# EAGLE design KoncovaCast (EAGLE 6.4)
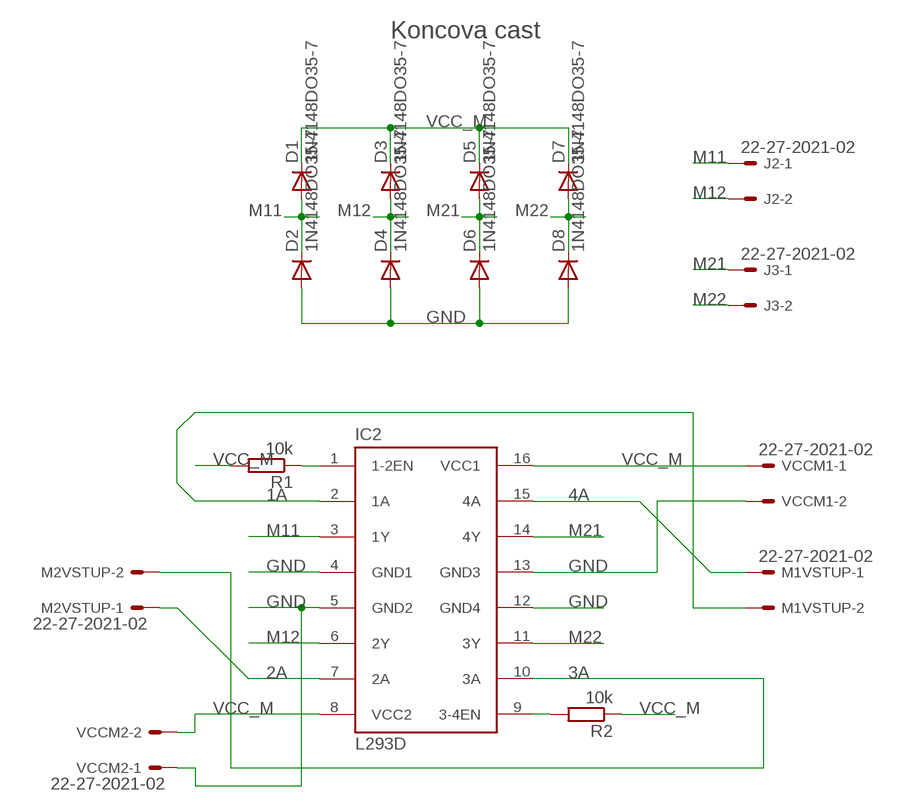
[diagram p0: schematic, sheet 1]

## Parts
D1  1N4148DO35-7  [DO35-7]
D2  1N4148DO35-7  [DO35-7]
D3  1N4148DO35-7  [DO35-7]
D4  1N4148DO35-7  [DO35-7]
D5  1N4148DO35-7  [DO35-7]
D6  1N4148DO35-7  [DO35-7]
D7  1N4148DO35-7  [DO35-7]
D8  1N4148DO35-7  [DO35-7]
IC2  L293D  [DIL16]
J2  22-27-2021-02  [6410-02]
J3  22-27-2021-02  [6410-02]
M1VSTUP  22-27-2021-02  [6410-02]
M2VSTUP  22-27-2021-02  [6410-02]
R1  10k  R-EU_0204/2V  [0204V]
R2  10k  R-EU_0204/2V  [0204V]
VCCM1  22-27-2021-02  [6410-02]
VCCM2  22-27-2021-02  [6410-02]

## Nets
1A: IC2.2(1A) M1VSTUP.2
2A: IC2.7(2A) M2VSTUP.1
3A: IC2.10(3A) M2VSTUP.2
4A: IC2.15(4A) M1VSTUP.1
GND: D2.A D4.A D6.A D8.A IC2.4(GND1) IC2.5(GND2) IC2.12(GND4) IC2.13(GND3) VCCM1.2 VCCM2.1
M11: D1.A D2.C IC2.3(1Y) J2.1
M12: D3.A D4.C IC2.6(2Y) J2.2
M21: D5.A D6.C IC2.14(4Y) J3.1
M22: D7.A D8.C IC2.11(3Y) J3.2
N$1: IC2.1(1-2EN) R1.1
N$2: IC2.9(3-4EN) R2.2
VCC_M: D1.C D3.C D5.C D7.C IC2.8(VCC2) IC2.16(VCC1) R1.2 R2.1 VCCM1.1 VCCM2.2

## Notes on the sheet
- Koncova cast

## Library data of the parts
D1-D8 = diode:1N4148: DIODE high speed (Philips)
IC2 = st-microelectronics:L293D: PUSH-PULL 4 CHANNEL DRIVER; MPN: L293D; OC_FARNELL: 9589619; OC_NEWARK: 56P8249
J2 J3 M1VSTUP M2VSTUP VCCM1 VCCM2 = con-molex:22-?-02: CONNECTOR wire to board 2.54 mm (.1 inch) pitch header; OC_FARNELL: unknown; OC_NEWARK: unknown
R1 R2 = resistor:R-EU_: RESISTOR, European symbol

## Board
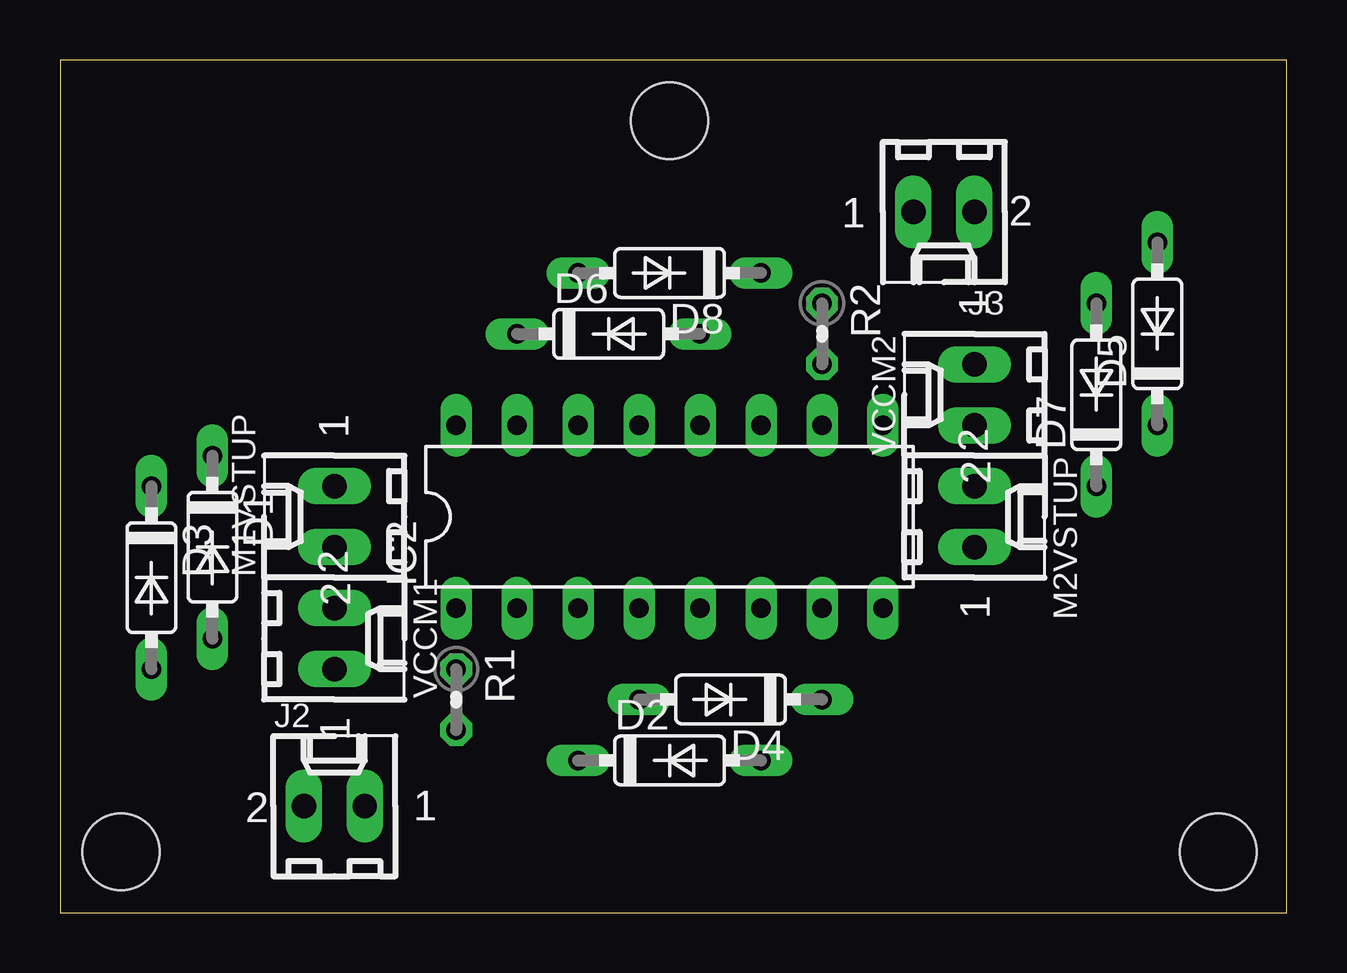
[diagram p1: board, top side]
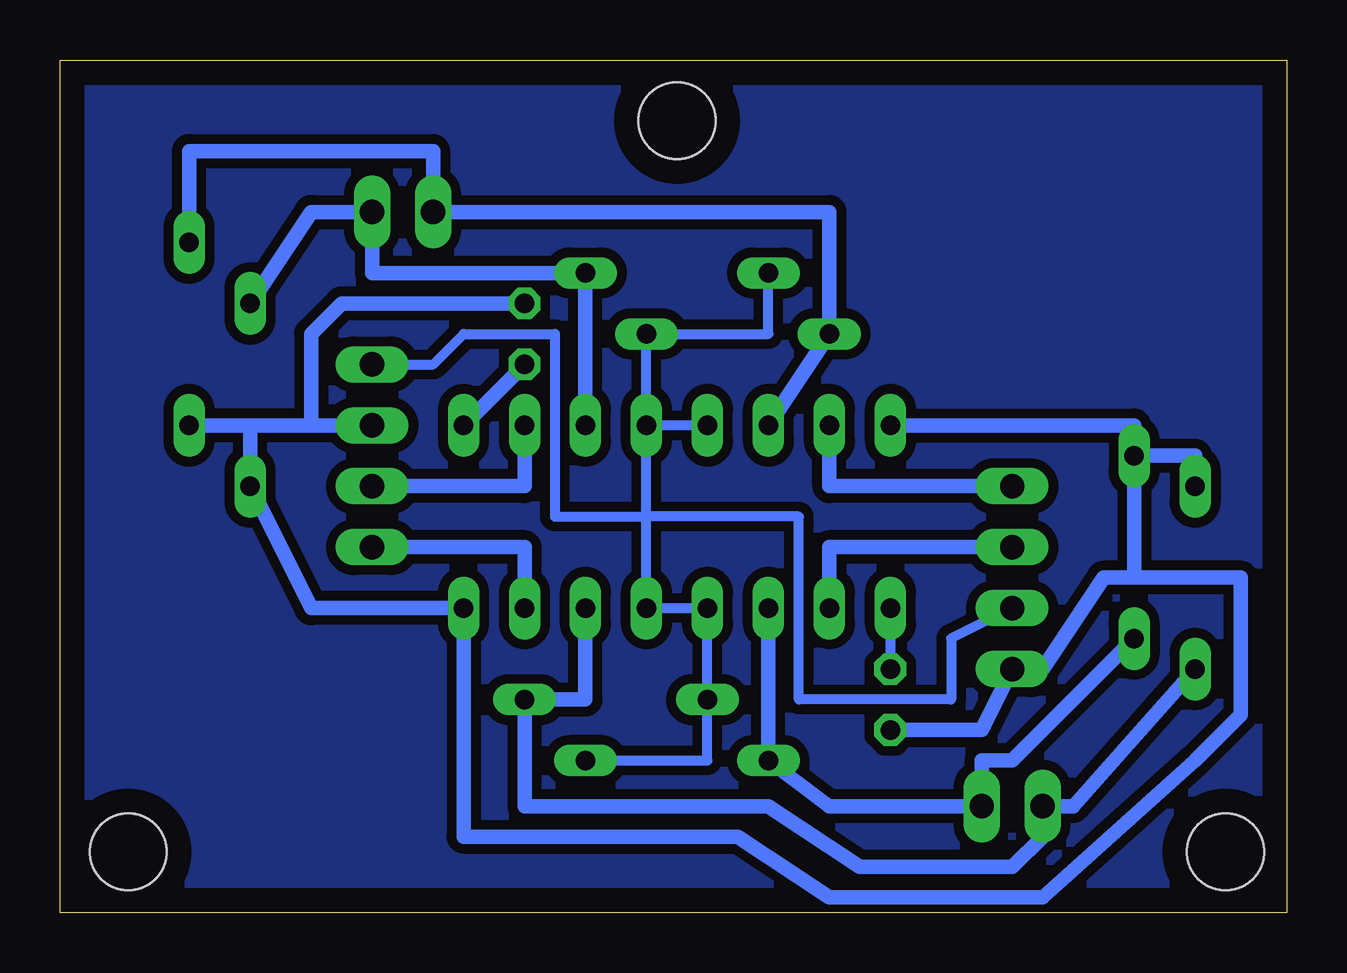
[diagram p2: board, bottom side, seen from below]

Size 51.1 x 35.55 mm. Coordinates in mm from the lower left corner, seen from the top.
Outline: 0,0 51.1,0 51.1,35.55 0,35.55 0,0
Copper layers (1*16): Top 0.035mm / dielectric 1.5mm / Bottom 0.035mm
Design rules "default": minimum track width 10mil, minimum drill 24mil, track to track 8mil, track to pad 8mil, pad to pad 8mil, via to via 8mil, smd to smd 8mil, copper to edge 40mil, drill to drill 8mil, minimum pad ring 10mil, minimum via ring 8mil, stop-mask expansion 4mil, vias tented up to drill 0mil, thermal gap 10mil
Holes 3.2 mm at 2.54,2.54 48.26,2.54 25.4,33.02

### Footprints (pad centres in the part's own frame; a part is rotated, then mirrored left to right if it is on the bottom)
DO35-7 = drill 0.813 long: A 3.81,0; C -3.81,0
DIL16 = drill 0.813 long: 1 -8.89,-3.81; 2 -6.35,-3.81; 3 -3.81,-3.81; 4 -1.27,-3.81; 5 1.27,-3.81; 6 3.81,-3.81; 7 6.35,-3.81; 8 8.89,-3.81; 9 8.89,3.81; 10 6.35,3.81; 11 3.81,3.81; 12 1.27,3.81; 13 -1.27,3.81; 14 -3.81,3.81; 15 -6.35,3.81; 16 -8.89,3.81
6410-02 = drill 1.016 long: 1 1.27,0; 2 -1.27,0
0204V = drill 0.813 octagon: 1 -1.27,0; 2 1.27,0

### Placement (x,y rotation side)
D1  6.35,15.24 270 top
D2  25.4,6.35 0 top
D3  3.81,13.97 270 top
D4  27.94,8.89 180 top
D5  45.72,24.13 90 top
D6  22.86,24.13 0 top
D7  43.18,21.59 90 top
D8  25.4,26.67 180 top
IC2  25.4,16.51 0 top
J2  11.43,4.45 0 top
J3  36.83,29.21 180 top
M1VSTUP  11.43,16.51 90 top
M2VSTUP  38.1,16.51 270 top
R1  16.51,8.89 270 top
R2  31.75,24.13 270 top
VCCM1  11.43,11.43 270 top
VCCM2  38.1,21.59 90 top

### Tracks (layer width: path | path; a pad name or v marks a point on that pad's centre or on a via)
1A
  Bottom 0.61: M1VSTUP.2 19.05,15.24 IC2.2
2A
  Bottom 0.61: IC2.7 31.75,15.24 M2VSTUP.1
3A
  Bottom 0.61: IC2.10 31.75,17.78 M2VSTUP.2
4A
  Bottom 0.61: M1VSTUP.1 19.05,17.78 IC2.15
GND
  Bottom 0.406: D2.A 24.13,6.35 D4.A IC2.4 IC2.5 26.67,16.51 | IC2.13 IC2.12 | 26.67,16.51 IC2.12 | IC2.12 D6.A 21.59,24.13 D8.A | VCCM2.1 35.56,22.86 34.29,24.13 30.48,24.13 30.48,16.51 26.67,16.51 | VCCM1.2 13.97,11.43 13.97,8.89 20.32,8.89 20.32,16.51 26.67,16.51
M
  pour Bottom (isolate 0.406): 0,35.56 50.8,35.56 50.8,0 0,0
M11
  Bottom 0.61: D1.A 11.43,6.35 12.7,6.35 J2.1 19.05,4.45 D2.C IC2.3
M12
  Bottom 0.406: J2.2 10.16,3.17
  Bottom 0.61: IC2.6 29.21,8.89 D4.C 31.75,4.45 21.59,4.45 17.78,1.91 11.43,1.91 10.16,3.17 | D3.A 8.89,4.45 J2.2
M21
  Bottom 0.61: IC2.14 D6.C 19.05,29.21 J3.1 35.56,31.75 45.72,31.75 D5.A
M22
  Bottom 0.61: D7.A 40.64,29.21 J3.2 38.1,26.67 D8.C IC2.11
N$1
  Bottom 0.406: IC2.1 R1.1
N$2
  Bottom 0.61: IC2.9 R2.2
N$3  (via drill 2)
  other vias: 25.4,33.02
N$4  (via drill 2)
  other vias: 48.26,2.54
N$5  (via drill 2)
  other vias: 2.54,2.54
VCC_M
  Bottom 0.61: VCCM2.2 40.64,20.32 | 40.64,20.32 43.18,20.32 | 43.18,20.32 D5.C | 43.18,20.32 D7.C 40.64,12.7 IC2.8 34.29,3.17 22.86,3.17 19.05,0.64 10.16,0.64 3.81,6.35 1.91,8.26 1.91,13.97 6.35,13.97 | R2.1 39.37,25.4 40.64,24.13 40.64,20.32 | R1.2 12.7,7.62 VCCM1.1 10.16,10.16 7.62,13.97 6.35,13.97 | D1.C 6.35,13.97 | D3.C 3.81,19.05 D1.C | IC2.16 6.35,20.32 D1.C